# EAGLE design Thermocouple_Wifi_V0 (EAGLE 9.6.2)
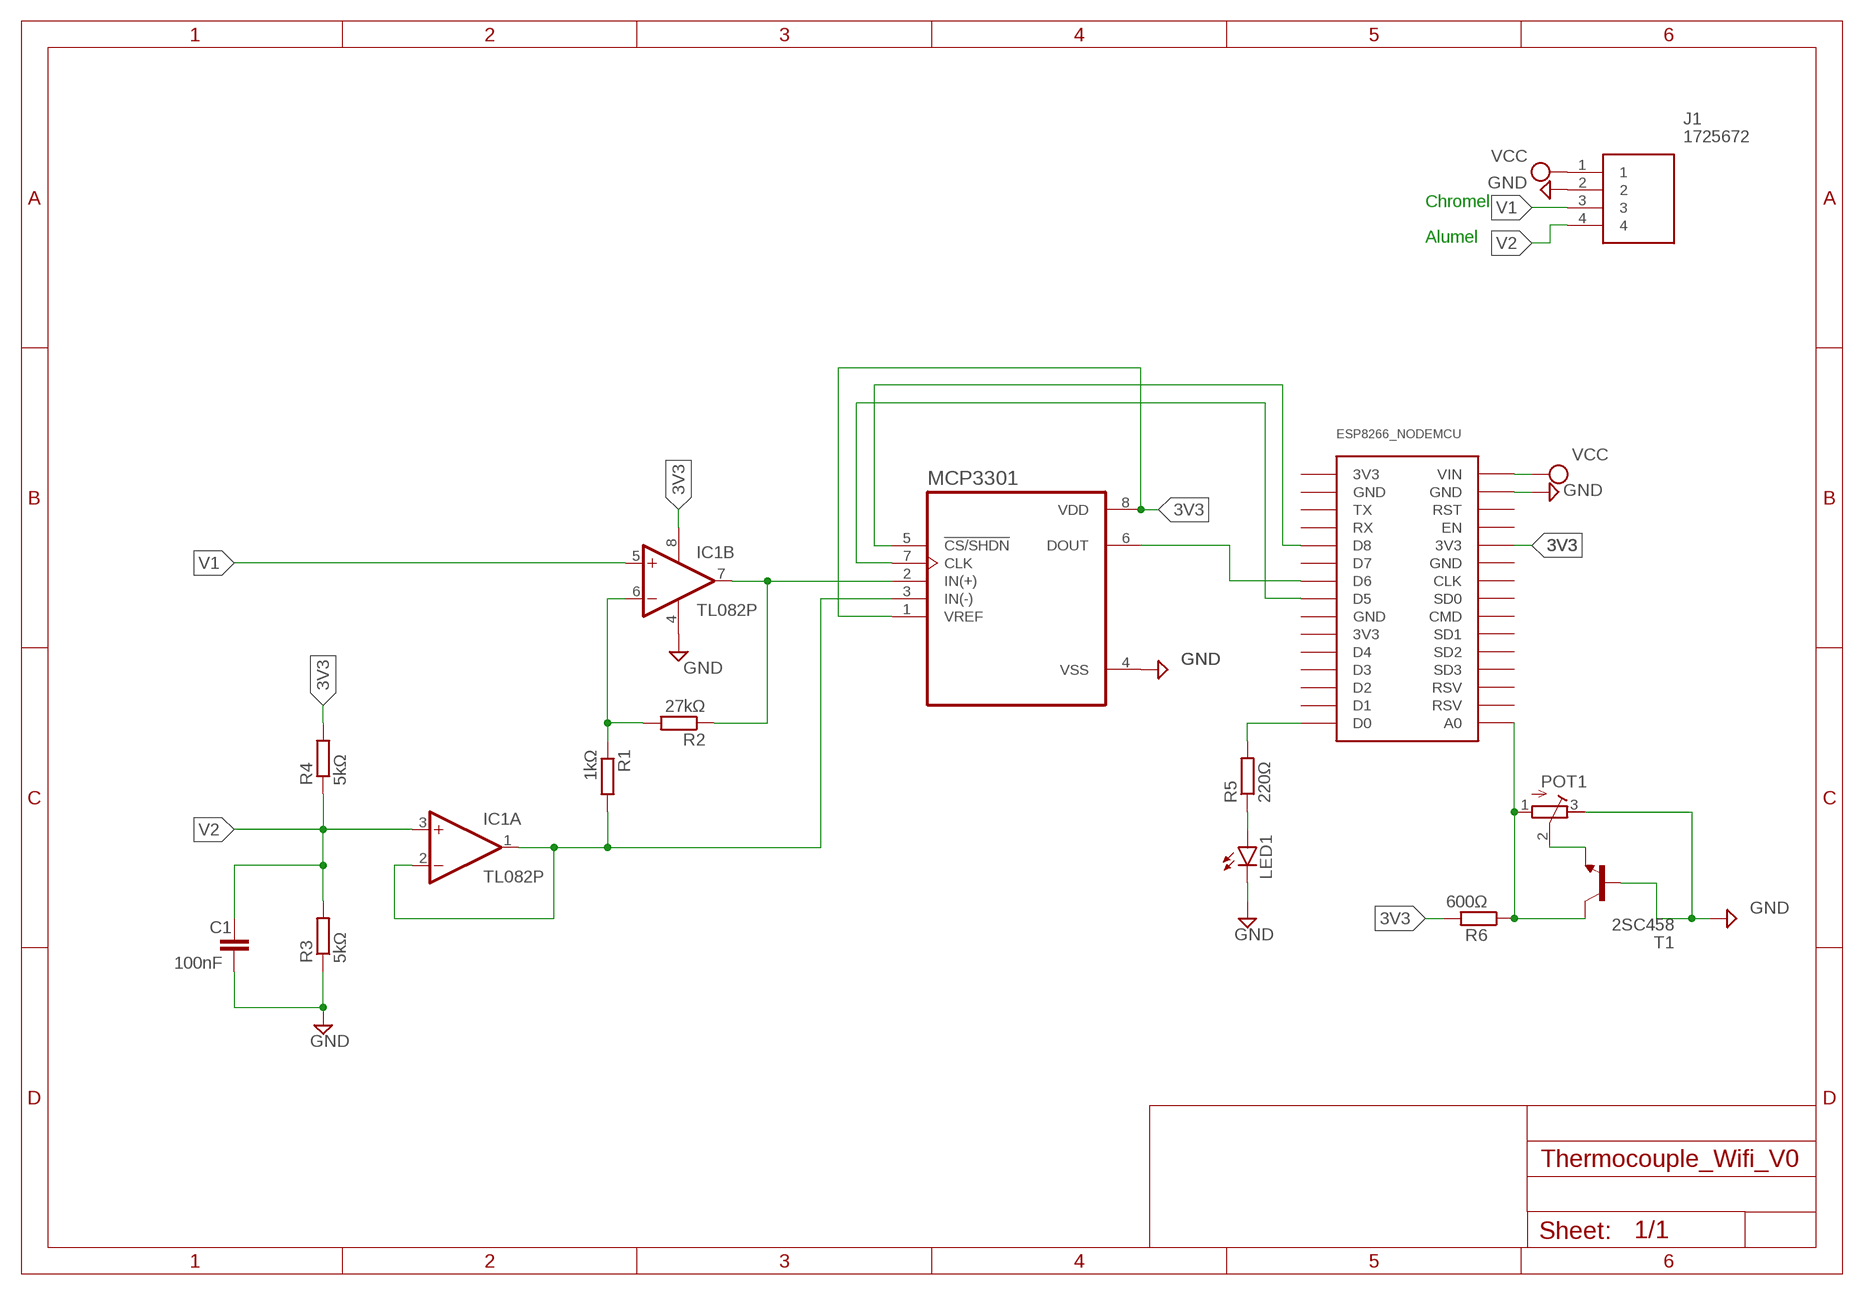
[diagram p0: schematic, sheet 1]

## Parts
C1  100nF  C-EU050-025X075  [C050-025X075]
ESP8266_NODEMCU  NODEMCU_ESP8266  [NODEMCU_ESP8266]
IC1  TL082P  [DIL08]
J1  1725672  [1725672-4-2.54]
LED1  LED5MM  [LED5MM]
MCP3301  MCP3301-CI/P  [DIP787W46P254L927H533Q8]
POT1  R-TRIMM74W  [RTRIM74W]
R1  1kΩ  R-EU_0204/7  [0204/7]
R2  27kΩ  R-EU_0204/7  [0204/7]
R3  5kΩ  R-EU_0204/7  [0204/7]
R4  5kΩ  R-EU_0204/7  [0204/7]
R5  220Ω  R-EU_0204/7  [0204/7]
R6  600Ω  R-EU_0204/7  [0204/7]
T1  2SC458  [TO92-ECB]

## Nets
3V3: ESP8266_NODEMCU.3V3@3(3V3) IC1.8(P:V+) MCP3301.1(VREF) MCP3301.8(VDD) R4.2 R6.2
GND: C1.2 ESP8266_NODEMCU.GND@4(GND) IC1.4(P:V-) J1.2 LED1.K(C) MCP3301.4(VSS) POT1.3(E) R3.1 T1.B
N$1: ESP8266_NODEMCU.D5 MCP3301.7(CLK)
N$2: ESP8266_NODEMCU.A0 POT1.1(A) R6.1 T1.C
N$3: ESP8266_NODEMCU.D6 MCP3301.6(DOUT)
N$4: ESP8266_NODEMCU.D8 MCP3301.5(!CS/SHDN)
N$6: LED1.A R5.1
N$7: POT1.2(S) T1.E
N$8: IC1.7(B:OUT) MCP3301.2(IN(+)) R2.1
N$11: IC1.1(A:OUT) IC1.2(A:-IN) MCP3301.3(IN(-)) R1.2
N$15: ESP8266_NODEMCU.D0 R5.2
N$16: IC1.6(B:-IN) R1.1 R2.2
V1: IC1.5(B:+IN) J1.3
V2: C1.1 IC1.3(A:+IN) J1.4 R3.2 R4.1
VCC: ESP8266_NODEMCU.VIN J1.1
Unconnected: ESP8266_NODEMCU.CLK ESP8266_NODEMCU.CMD ESP8266_NODEMCU.D1 ESP8266_NODEMCU.D2 ESP8266_NODEMCU.D3 ESP8266_NODEMCU.D4 ESP8266_NODEMCU.D7 ESP8266_NODEMCU.EN ESP8266_NODEMCU.RST ESP8266_NODEMCU.RSV1(RSV) ESP8266_NODEMCU.RSV2(RSV) ESP8266_NODEMCU.RX ESP8266_NODEMCU.SD1 ESP8266_NODEMCU.SD2 ESP8266_NODEMCU.SD3 ESP8266_NODEMCU.SDO(SD0) ESP8266_NODEMCU.TX

## Notes on the sheet
- Chromel
- Alumel

## Power pins joined to a net without a drawn wire
3V3: ESP8266_NODEMCU.3V3@1(3V3) ESP8266_NODEMCU.3V3@2(3V3)
GND: ESP8266_NODEMCU.GND@1(GND) ESP8266_NODEMCU.GND@2(GND) ESP8266_NODEMCU.GND@3(GND)

## Library data of the parts
C1 = rcl:C-EU: CAPACITOR, European symbol; SPICEPREFIX: C
ESP8266_NODEMCU = nodemcu_esp8266:NODEMCU_ESP8266: Node MCU V2 (ESP8266) Created by Harish
IC1 = linear:TL082: OP AMP Data sheet <http://www.ti.com/lit/ds/symlink/tl084a . pdf>; DATA_SHEET: <a href="http://www.ti.com/lit/ds/symlink/tl084a.pdf"> Data sheet </a>
J1 = 1725672:1725672: 4 way vertical PCB terminal,6A 63V Phoenix Contact Non-Fused Terminal Block, 4 Way, Solder Terminals, 26 ??? 20 AWG Through Hole, Nylon, 63 V Source: <a href="https://www.phoenixcontact.com/online/portal/us?uri=pxc-oc-itemdetail:pid=1725672&library=usen&tab=1.pdf"> Datasheet </a> Check availability <https://pricing.snapeda.com/parts/17%2025%2067%202/Phoenix%20Contact/view-part?ref=eda>; AVAILABILITY: In Stock; DESCRIPTION: ROHS / BORNIER FIXE CI 1RX4C / TYPE MPT 0-5/ 4-2-54 / BOX 50 PCS; MF: Phoenix Contact; MP: 17 25 67 2; PACKAGE: None; PRICE: None
LED1 = led:LED: LED OSRAM: - CHIPLED LG R971, LG N971, LY N971, LG Q971, LY Q971, LO R971, LY R971 LH N974, LH R974 LS Q976, LO Q976, LY Q976 LO Q996 - Hyper CHIPLED LW Q18S LB Q993, LB Q99A, LB R99A - SideLED LS A670, LO A670, LY A670, LG A670, LP A670 LB A673, LV A673, LT A673, LW A673 LH A674 LY A675 LS A676, LA A676, LO A676, LY A676, LW A676 LS A679, LY A679, LG A679 - Hyper Micro SIDELED® LS Y876, LA Y876, LO Y876, LY Y876 LT Y87S - SmartLED LW L88C, LW L88S LB L89C, LB L89S, LG L890 LS L89K, LO L89K, LY L89K LS L896, LA L896, LO L896, LY L896 - TOPLED LS T670, LO T670, LY T670, LG T670, LP T670 LSG T670, LSP T670, LSY T670, LOP T670, LYG T670 LG T671, LOG T671, LSG T671 LB T673, LV T673, LT T673, LW T673 LH T674 LS T676, LA T676, LO T676, LY T676, LB T676, LH T676, LSB T676, LW T676 LB T67C, LV T67C, LT T67C, LS T67K, LO T67K, LY T67K, LW E67C LS E67B, LA E67B, LO E67B, LY E67B, LB E67C, LV E67C, LT E67C LW T67C LS T679, LY T679, LG T679 LS T770, LO T770, LY T770, LG T770, LP T770 LB T773, LV T773, LT T773, LW T773 LH T774 LS E675, LA E675, LY E675, LS T675 LS T776, LA T776, LO T776, LY T776, LB T776 LHGB T686 LT T68C, LB T68C - Hyper Mini TOPLED® LB M676 - Mini TOPLED Santana® LG M470 LS M47K, LO M47K, LY M47K Source: http://www.osram.convergy.de LUXEON: - LUMILED® LXK2-PW12-R00, LXK2-PW12-S00, LXK2-PW14-U00, LXK2-PW14-V00 LXK2-PM12-R00, LXK2-PM12-S00, LXK2-PM14-U00 LXK2-PE12-Q00, LXK2-PE12-R00, LXK2-PE12-S00, LXK2-PE14-T00, LXK2-PE14-U00 LXK2-PB12-K00, LXK2-PB12-L00, LXK2-PB12-M00, LXK2-PB14-N00, LXK2-PB14-P00, LXK2-PB14-Q00 LXK2-PR12-L00, LXK2-PR12-M00, LXK2-PR14-Q00, LXK2-PR14-R00 LXK2-PD12-Q00, LXK2-PD12-R00, LXK2-PD12-S00 LXK2-PH12-R00, LXK2-PH12-S00 LXK2-PL12-P00, LXK2-PL12-Q00, LXK2-PL12-R00 Source: www.luxeon.com KINGBRIGHT: KA-3528ASYC Source: www.kingbright.com
MCP3301 = MCP3301-CI_P:MCP3301-CI/P: Check availability <https://pricing.snapeda.com/parts/MCP3301-CI/P/Microchip/view-part?ref=eda>; AVAILABILITY: In Stock; DESCRIPTION: 13 Bit Analog to Digital Converter 1 Input 1 SAR 8-PDIP; MF: Microchip; MP: MCP3301-CI/P; PACKAGE: DIP-8 Microchip; PRICE: None; PURCHASE-URL: https://pricing.snapeda.com/search/part/MCP3301-CI/P/?ref=eda
POT1 = rcl:R-TRIMM: Trimm resistor; SPICEMODEL: X; SPICEPREFIXL: POT
R1-R6 = rcl:R-EU_: RESISTOR, European symbol; SPICEPREFIX: R
T1 = transistor:2SC458: NPN Silicon Epitaxial Planar Transistor Source: SEMTECH ELECTRONICS LTD. ... 2SC458 1.pdf

## Board
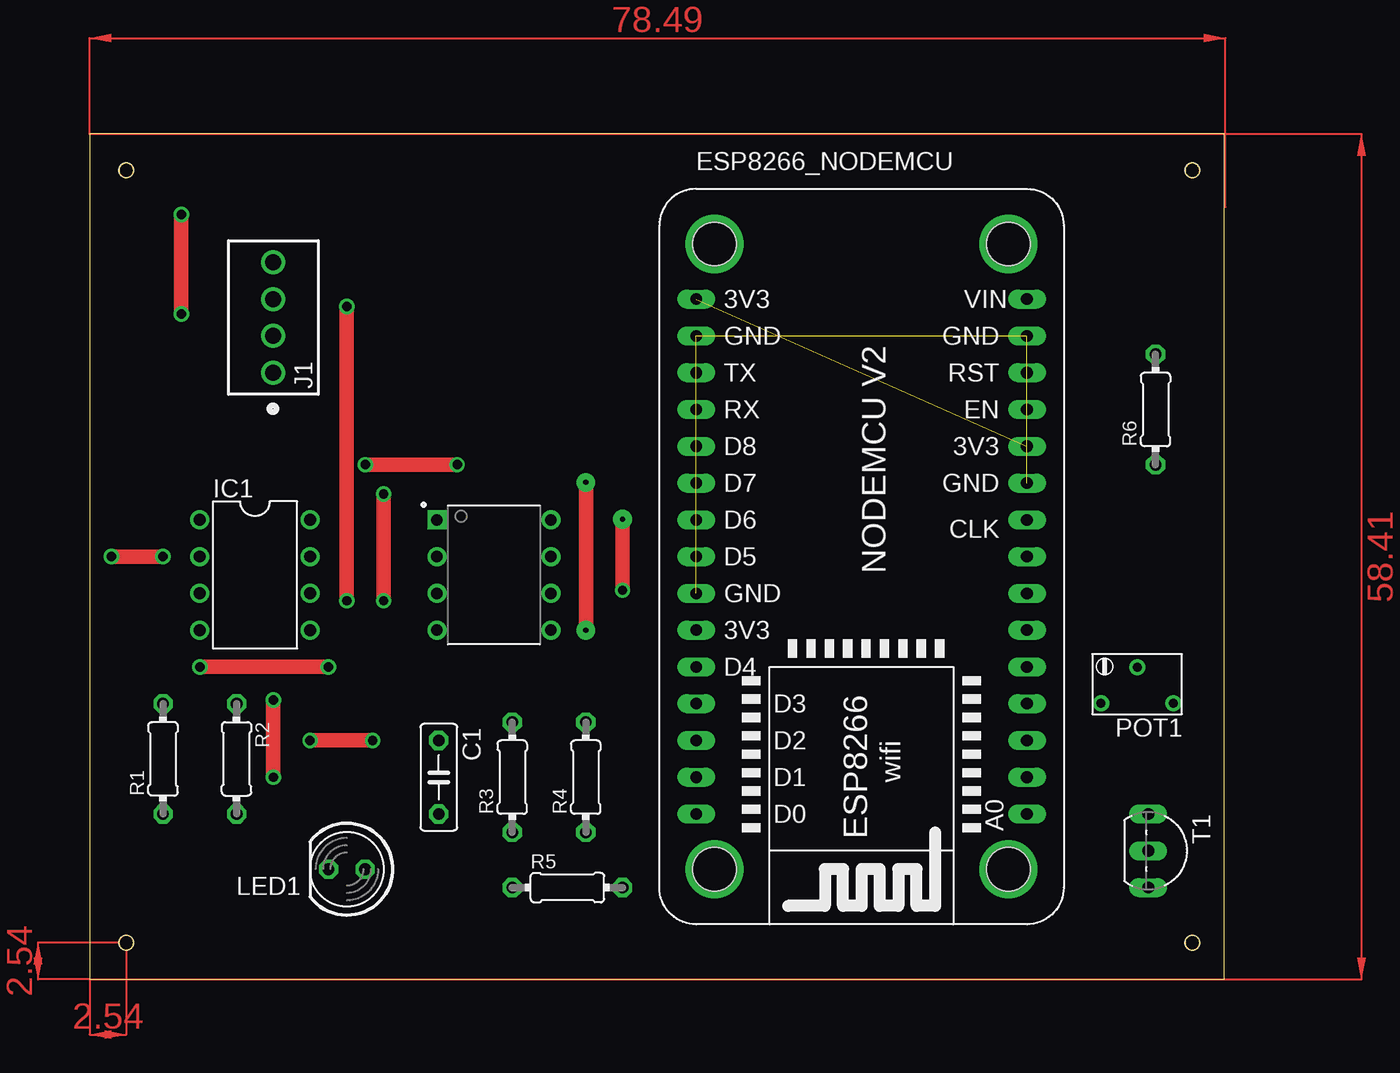
[diagram p1: board, top side]
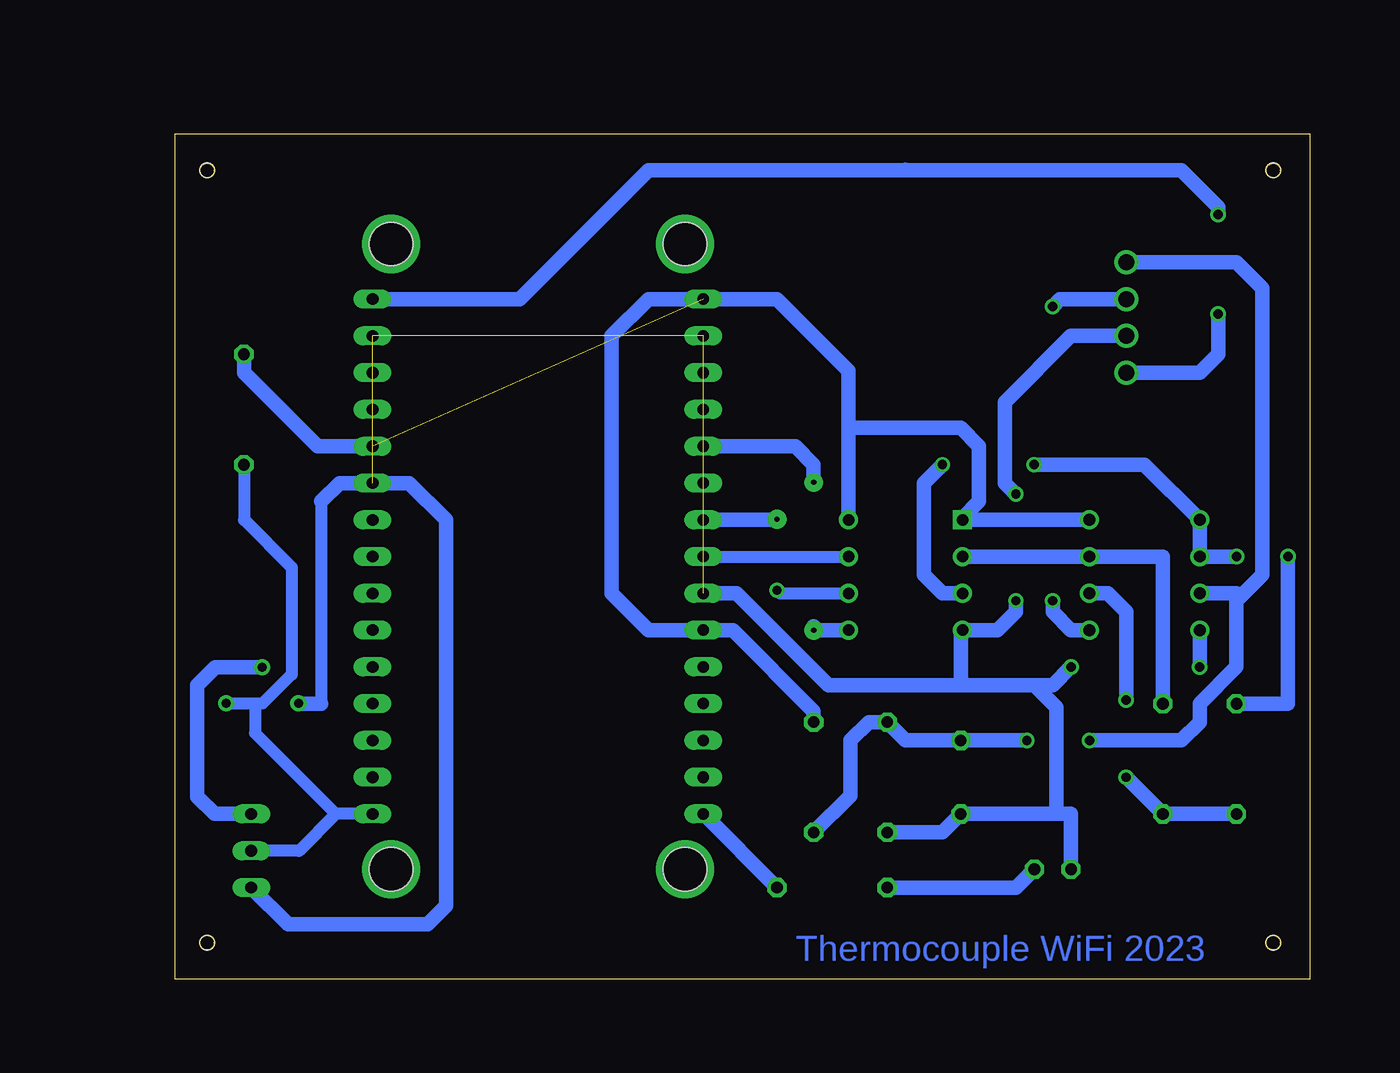
[diagram p2: board, bottom side, seen from below]

Size 78.41 x 58.41 mm. Coordinates in mm from the lower left corner, seen from the top.
Outline: 2.04,55.85 arc174 3.04,55.85 3.04,55.91 arc174 2.04,55.91 2.04,55.85
Outline: 2.04,2.51 arc174 3.04,2.51 3.04,2.57 arc174 2.04,2.57 2.04,2.51
Outline: 75.7,2.51 arc174 76.7,2.51 76.7,2.57 arc174 75.7,2.57 75.7,2.51
Outline: 75.7,55.85 arc174 76.7,55.85 76.7,55.91 arc174 75.7,55.91 75.7,55.85
Outline: 0,58.41 0,0 78.41,0 78.41,58.41 0,58.41
Copper layers (1*16): Top 0.035mm / dielectric 1.5mm / Bottom 0.035mm
Design rules "default": minimum track width 6mil, minimum drill 0.35mm, track to track 6mil, track to pad 6mil, pad to pad 6mil, via to via 6mil, smd to smd 6mil, copper to edge 40mil, drill to drill 6mil, minimum pad ring 10mil, minimum via ring 8mil, stop-mask expansion 4mil, vias tented up to drill 0mil, thermal gap 10mil
Holes 3 mm at 63.5,50.8 63.5,7.62 43.18,7.62 43.18,50.8
Holes 1 mm at 2.54,55.88 76.2,55.88 76.2,2.54 2.54,2.54

### Footprints (pad centres in the part's own frame; a part is rotated, then mirrored left to right if it is on the bottom)
C050-025X075 = drill 0.813 octagon: 1 -2.54,0; 2 2.54,0
NODEMCU_ESP8266 = drill 0.8 long: 3V3@1 -11.43,19.05; 3V3@2 -11.43,-3.81; 3V3@3 11.43,8.89; A0 11.43,-16.51; CLK 11.43,3.81; CMD 11.43,-1.27; D0 -11.43,-16.51; D1 -11.43,-13.97; D2 -11.43,-11.43; D3 -11.43,-8.89; D4 -11.43,-6.35; D5 -11.43,1.27; D6 -11.43,3.81; D7 -11.43,6.35; D8 -11.43,8.89; EN 11.43,11.43; GND@1 -11.43,16.51; GND@2 -11.43,-1.27; GND@3 11.43,6.35; GND@4 11.43,16.51; RST 11.43,13.97; RSV1 11.43,-11.43; RSV2 11.43,-13.97; RX -11.43,11.43; SD1 11.43,-3.81; SD2 11.43,-6.35; SD3 11.43,-8.89; SDO 11.43,1.27; TX -11.43,13.97; VIN 11.43,19.05 | drill 3: P$31 10.16,22.86; P$32 -10.16,22.86; P$33 -10.16,-20.32; P$34 10.16,-20.32 | hole 3: 10.16,22.86; 10.16,-20.32; -10.16,-20.32; -10.16,22.86
DIL08 = drill 0.813 pad 1.27: 1 -3.81,-3.81; 2 -1.27,-3.81; 3 1.27,-3.81; 4 3.81,-3.81; 5 3.81,3.81; 6 1.27,3.81; 7 -1.27,3.81; 8 -3.81,3.81
1725672-4-2.54 = drill 1.1 pad 1.65: 1 0,0; 2 2.54,0; 3 5.08,0; 4 7.62,0
LED5MM = drill 0.813 octagon: A -1.27,0; K 1.27,0
DIP787W46P254L927H533Q8 = drill 0.8 square: 1 -3.935,3.81 | drill 0.8: 2 -3.935,1.27; 3 -3.935,-1.27; 4 -3.935,-3.81; 5 3.935,-3.81; 6 3.935,-1.27; 7 3.935,1.27; 8 3.935,3.81
RTRIM74W = drill 0.61: 1 -1.25,-2.5; 2 1.25,0; 3 -1.25,2.5
0204/7 = drill 0.813 octagon: 1 -3.81,0; 2 3.81,0
TO92-ECB = drill 0.813 long: B 2.54,0; C 0,0; E -2.54,0

### Placement (x,y rotation side)
C1  24.13,13.97 270 top
ESP8266_NODEMCU  53.34,27.94 0 top
IC1  11.43,27.94 270 top
J1  12.7,41.91 90 top
LED1  17.78,7.62 180 top
MCP3301  27.94,27.94 0 top
POT1  72.39,20.32 90 top
R1  5.08,15.24 90 top
R2  10.16,15.24 270 top
R3  29.21,13.97 90 top
R4  34.29,13.97 90 top
R5  33.02,6.35 0 top
R6  73.66,39.37 90 top
T1  73.15,8.89 270 top

### Tracks (layer width: path | path; a pad name or v marks a point on that pad's centre or on a via)
3V3  (1 unrouted)
  Bottom 1.016: ESP8266_NODEMCU.3V3@3 68.58,36.83 73.66,41.91 R6.2 | 31.87,38.1 31.87,42.03 36.83,46.99 ESP8266_NODEMCU.3V3@1 45.72,46.99 48.26,44.45 48.26,26.67 45.72,24.13 ESP8266_NODEMCU.3V3@2 39.88,24.13 34.29,18.54 R4.2 | MCP3301.8 31.87,38.1 | 31.87,38.1 24.13,38.1 22.86,36.83 22.86,33.02 24,31.88 MCP3301.1 IC1.8
GND  (via drill 0.65)  (3 unrouted)
  Top 1.016: v16.51,21.59 v7.62,21.59 | v20.32,26.16 v20.32,33.53
  Bottom 0.813: 68.33,33.02 68.33,19.05
  Bottom 1.016: J1.2 16.51,44.45 21.08,39.88 21.08,34.29 v20.32,33.53 | ESP8266_NODEMCU.GND@2 39.62,26.67 33.27,20.32 24.13,20.32 | R3.1 25.4,10.16 C1.2 17.53,11.43 | 68.33,33.02 67.06,34.29 ESP8266_NODEMCU.GND@3 62.23,34.29 59.69,31.75 59.69,5.08 60.96,3.81 70.61,3.81 T1.B | LED1.K 16.51,11.43 17.53,11.43 | 17.53,11.43 17.53,18.8 19.05,20.32 | 24.13,20.32 19.05,20.32 | 24.13,20.32 24.13,24.25 MCP3301.4 21.59,24.13 20.32,25.4 v20.32,26.16 | 19.05,20.32 17.78,20.32 v16.51,21.59 | v7.62,21.59 IC1.4 | 68.33,19.05 69.87,19.05 POT1.3
N$1
  Bottom 0.813: ESP8266_NODEMCU.D5 MCP3301.7
N$2
  Bottom 0.813: R6.1 73.66,31.75 70.36,28.45 70.36,21.08 72.39,19.05 72.9,19.05 | 72.9,19.05 74.87,19.05 | ESP8266_NODEMCU.A0 67.31,11.43 | T1.C 69.85,8.89 67.31,11.43 | 72.9,19.05 72.9,17.02 67.31,11.43
  Bottom 1.016: 74.87,19.05 POT1.1
N$3  (via drill 0.35 pad 1.3, 0.65)
  Top 1.016: v36.83,26.88 v36.83,31.79
  Bottom 0.813: v36.83,26.88 36.62,26.67 MCP3301.6
  Bottom 1.016: v36.83,26.88 36.83,26.92 | v36.83,31.79 36.87,31.75 ESP8266_NODEMCU.D6
N$4  (via drill 0.35 pad 1.3)
  Top 1.016: v34.29,34.33 v34.29,24.13
  Bottom 1.016: ESP8266_NODEMCU.D8 35.56,36.83 34.29,35.56 v34.29,34.33 34.29,34.29 | MCP3301.5 34.04,24.13 34.29,24.38 v34.29,24.13
N$6
  Bottom 1.016: R5.1 20.32,6.35 LED1.A
N$7
  Bottom 1.016: POT1.2 75.64,21.57 76.89,20.32 76.89,12.62 75.69,11.43 T1.E
N$8
  Bottom 1.016: R2.1 10.16,29.21 IC1.7 MCP3301.2
N$11  (via drill 0.65)
  Top 1.016: v5.08,29.21 v1.52,29.21 | v19.05,35.56 v25.4,35.56
  Bottom 1.016: v5.08,29.21 IC1.2 IC1.1 11.43,35.56 v19.05,35.56 | MCP3301.3 25.4,26.67 26.67,27.94 26.67,34.29 v25.4,35.56 | R1.2 1.52,19.05 v1.52,29.21
N$15
  Bottom 1.016: R5.2 ESP8266_NODEMCU.D0
N$16  (via drill 0.65)
  Top 1.016: v12.7,19.3 v12.7,13.97
  Bottom 1.016: R1.1 R2.2 v12.7,13.97 | IC1.6 13.97,26.67 12.7,25.4 v12.7,19.3
V1  (via drill 0.65)
  Top 1.016: v17.78,46.48 v17.78,26.16
  Bottom 1.016: v17.78,46.48 17.27,46.99 J1.3 | v17.78,26.16 17.78,25.4 16.51,24.13 IC1.5
V2  (via drill 0.65)
  Top 1.016: v15.24,16.51 v19.56,16.51
  Bottom 1.016: R4.1 31.75,12.7 31.75,16.51 30.48,17.78 R3.2 27.94,16.51 C1.1 v19.56,16.51 | 5.08,26.16 3.3,27.94 3.3,47.75 5.08,49.53 J1.4 | IC1.3 5.08,26.67 5.08,26.16 | 5.08,26.16 5.08,21.59 7.62,19.05 7.62,17.78 8.89,16.51 v15.24,16.51
VCC  (via drill 0.65)
  Top 1.016: v6.35,52.83 v6.35,45.97
  Bottom 1.016: 27.94,55.88 45.72,55.88 54.61,46.99 ESP8266_NODEMCU.VIN | 27.94,55.88 27.94,55.92 | J1.1 7.62,41.91 6.35,43.18 v6.35,45.97 | 27.94,55.88 8.89,55.88 6.35,53.34 v6.35,52.83
(copper drawn outside any net)
  shapes: Top area x4

### Text on the board
Bottom: Thermocouple WiFi 2023